# Altium schematic sheet bb_optocouplers.SchDoc
size A4; SheetNumber: 4; SheetTotal: 6
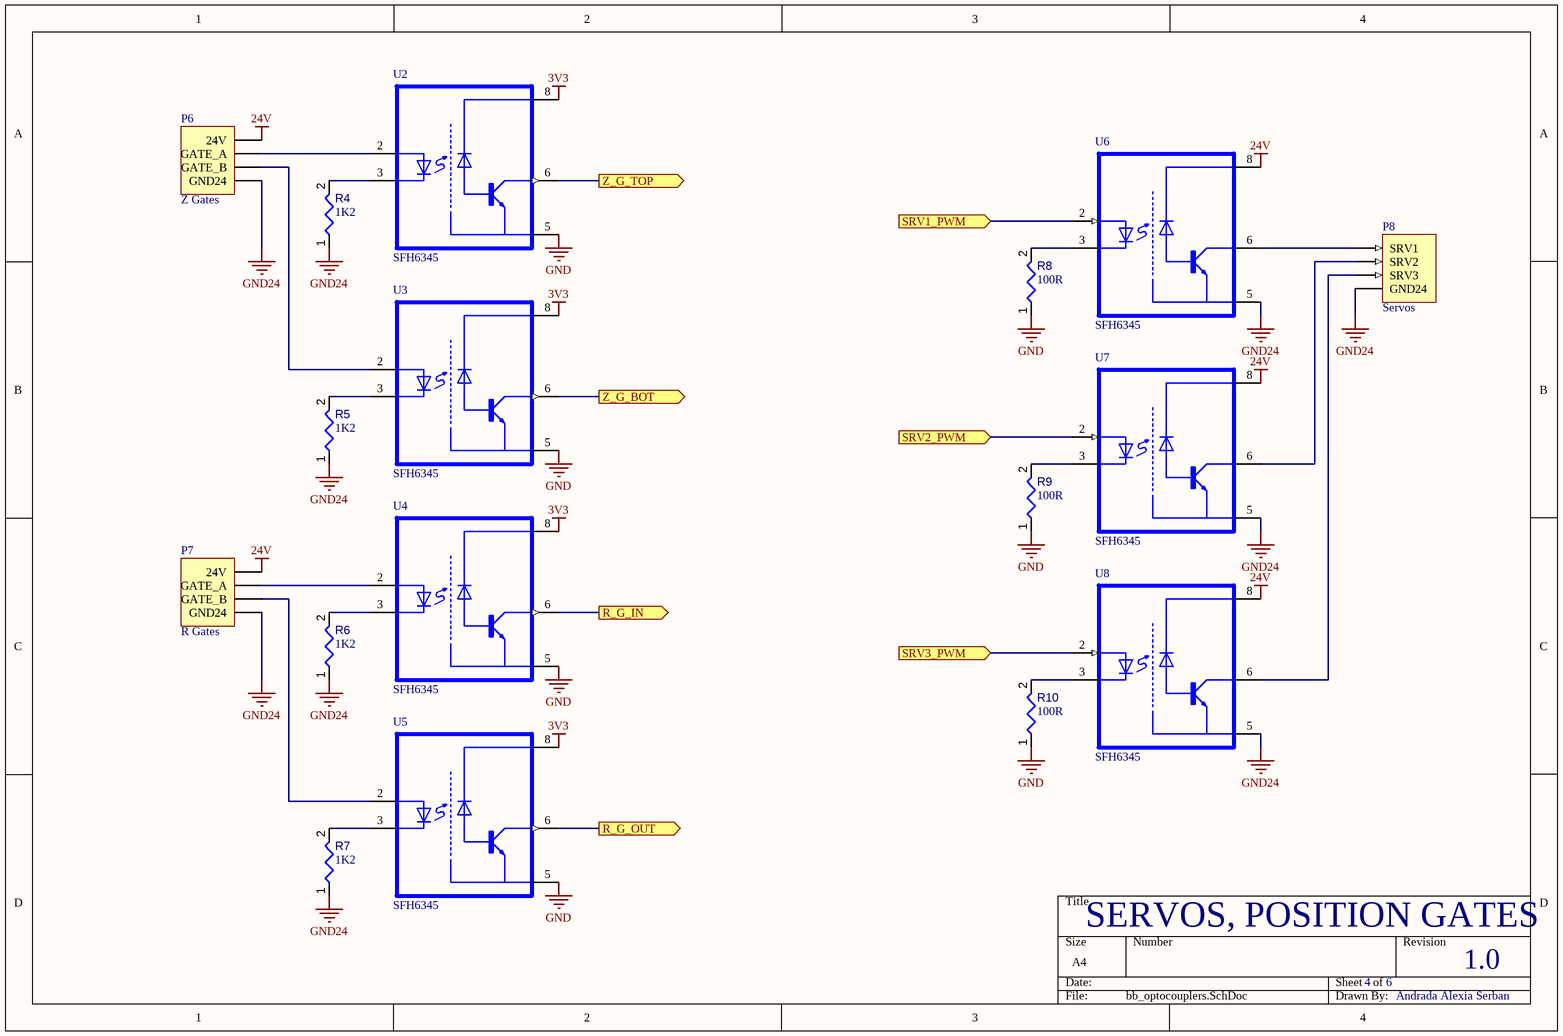
[diagram p0: bb_optocouplers.SchDoc]

## Parts
P6  Z Gates  [FP_CONN4_TAP_254MM]
P7  R Gates  [FP_CONN4_TAP_254MM]
P8  Servos  [FP_CONN4_TAP_254MM]
R4  value 1K2  [RESC0402(1005)_L]  (hidden comment: Resistor 200R +/-5 % 0402 63 mW)
R5  value 1K2  [RESC0402(1005)_L]  (hidden comment: Resistor 200R +/-5 % 0402 63 mW)
R6  value 1K2  [RESC0402(1005)_L]  (hidden comment: Resistor 200R +/-5 % 0402 63 mW)
R7  value 1K2  [RESC0402(1005)_L]  (hidden comment: Resistor 200R +/-5 % 0402 63 mW)
R8  value 100R  [RESC0402(1005)_L]  (hidden comment: Resistor 200R +/-5 % 0402 63 mW)
R9  value 100R  [RESC0402(1005)_L]  (hidden comment: Resistor 200R +/-5 % 0402 63 mW)
R10  value 100R  [RESC0402(1005)_L]  (hidden comment: Resistor 200R +/-5 % 0402 63 mW)
U2  SFH6345  [DIP762W50P254L977H451Q8]
U3  SFH6345  [DIP762W50P254L977H451Q8]
U4  SFH6345  [DIP762W50P254L977H451Q8]
U5  SFH6345  [DIP762W50P254L977H451Q8]
U6  SFH6345  [DIP762W50P254L977H451Q8]
U7  SFH6345  [DIP762W50P254L977H451Q8]
U8  SFH6345  [DIP762W50P254L977H451Q8]

## Ports
R_G_IN (out, see bb_Nucleo[4B]), R_G_OUT (out, see bb_Nucleo[4B]), SRV1_PWM (in, see bb_Nucleo[1A]), SRV2_PWM (in, see bb_Nucleo[1B]), SRV3_PWM (in, see bb_Nucleo[1C]), Z_G_BOT (out, see bb_Nucleo[4B]), Z_G_TOP (out, see bb_Nucleo[4B])

## Nets
3V3: U2.8(VCC) U3.8(VCC) U4.8(VCC) U5.8(VCC)
24V: P6.4(24V) P7.4(24V) U6.8(VCC) U7.8(VCC) U8.8(VCC)
GND: R8.1 R9.1 R10.1 U2.5(E) U3.5(E) U4.5(E) U5.5(E)
GND24: P6.1(GND24) P7.1(GND24) P8.4(GND24) R4.1 R5.1 R6.1 R7.1 U6.5(E) U7.5(E) U8.5(E)
R_G_IN: U4.6(CO) ; port R_G_IN
R_G_OUT: U5.6(CO) ; port R_G_OUT
SRV1_PWM: U6.2(A) ; port SRV1_PWM
SRV2_PWM: U7.2(A) ; port SRV2_PWM
SRV3_PWM: U8.2(A) ; port SRV3_PWM
Z_G_BOT: U3.6(CO) ; port Z_G_BOT
Z_G_TOP: U2.6(CO) ; port Z_G_TOP
NetP6_2: P6.2(GATE_B) U3.2(A)
NetP6_3: P6.3(GATE_A) U2.2(A)
NetP7_2: P7.2(GATE_B) U5.2(A)
NetP7_3: P7.3(GATE_A) U4.2(A)
NetP8_1: P8.1(SRV1) U6.6(CO)
NetP8_2: P8.2(SRV2) U7.6(CO)
NetP8_3: P8.3(SRV3) U8.6(CO)
NetR4_2: R4.2 U2.3(C)
NetR5_2: R5.2 U3.3(C)
NetR6_2: R6.2 U4.3(C)
NetR7_2: R7.2 U5.3(C)
NetR8_2: R8.2 U6.3(C)
NetR9_2: R9.2 U7.3(C)
NetR10_2: R10.2 U8.3(C)

## Notes on the sheet
- SERVOS, POSITION GATES
- 4
- 6
- 1.0
- Andrada Alexia Serban

## Library data of the parts
P6-P8 = Connector_4pin: 4pin Connector
R4-R10 = CMP-009-00161-3: Chip Resistor, 200 Ohms, +/-5 %, 63 mW, -55 to 155 degC, 0402; Power: 63mW; Tolerance: 5%; Min Operating Temperature: -55°C; Case/Package: 0402; Max Operating Temperature: 155°C; Pins: 2
U2-U8 = CMP-013-000000-1: Analog High Speed Coupler, High Noise Immunity, 1 MBd, 15 kV/ÎĽs; Pin Count: 5; Source: SFH6345.SchLib; MP: SFH6345; Design Item ID: SFH6345; Price: None; Availability: Unavailable; Component Type: Standard; Package: None; Value: *